# EAGLE schematic untitled (EAGLE 6.2)
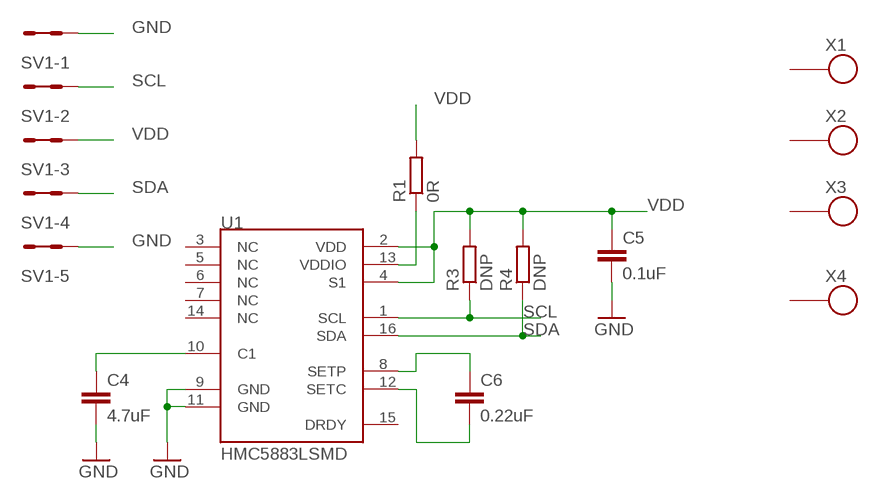
[diagram p0: schematic, sheet 1]

## Parts
C4  4.7uF  C0805  [C0805]
C5  0.1uF  C0805  [C0805]
C6  0.22uF  C0805  [C0805]
R1  0R  R1206  [1206]
R3  DNP  R0805  [0805]
R4  DNP  R0805  [0805]
SV1  MA05-2  [MA05-2]
U1  HMC5883LSMD  [16LPCC]
X1  SROUB3M  [SROUB3M]
X2  SROUB3M  [SROUB3M]
X3  SROUB3M  [SROUB3M]
X4  SROUB3M  [SROUB3M]

## Nets
GND: C4.2 C5.2 SV1.1 SV1.2 SV1.9 SV1.10 U1.9(GND) U1.11(GND)
N$1: C4.1 U1.10(C1)
N$2: R1.1 U1.13(VDDIO)
N$4: C6.1 U1.8(SETP)
N$5: C6.2 U1.12(SETC)
SCL: R3.1 SV1.3 SV1.4 U1.1(SCL)
SDA: R4.1 SV1.7 SV1.8 U1.16(SDA)
VDD: C5.1 R1.2 R3.2 R4.2 SV1.5 SV1.6 U1.2(VDD) U1.4(S1)
Unconnected: U1.3(NC) U1.5(NC) U1.6(NC) U1.7(NC) U1.14(NC) U1.15(DRDY) X1.P$1 X2.P$1 X3.P$1 X4.P$1

## Notes on the sheet
- GND
- SCL
- VDD
- VDD
- SDA
- VDD
- GND

## Library data of the parts
C4-C6 = moje_C:C0805
R1 = moje_R:R1206
R3 R4 = moje_R:R0805
SV1 = moje_hrebinky:MA05-2: PIN HEADER; OC_FARNELL: unknown; OC_NEWARK: unknown
U1 = SparkFun:HMC5883L: 3 Axis Digital Compass IC
X1-X4 = moje:SROUB3M